# Altium project HotBox.PrjPcb
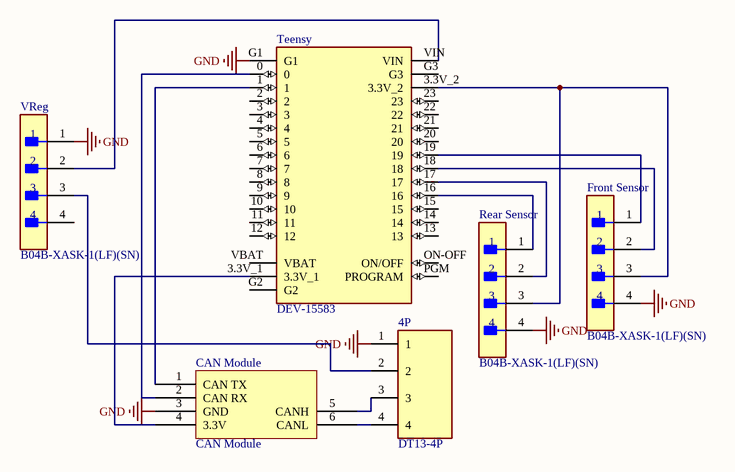
[diagram p0: HotBox.SchDoc]
1 sheet, 6 parts. Net scope: global (net labels, ports and power ports of the same name join across sheets).
Board file: Hotbox.PcbDoc

## Sheet HotBox.SchDoc
size A2; SheetNumber: 1; SheetTotal: 1

### Parts
4P  DT13-4P  [TE_DT13-4P]
CAN_Module  CAN Module  [CAN Module-Footprint-1]
Front_Sensor  B04B-XASK-1(LF)(SN)  [FP-B04B-XASK-1_LF_SN-MFG]
Rear_Sensor  B04B-XASK-1(LF)(SN)  [FP-B04B-XASK-1_LF_SN-MFG]
Teensy  DEV-15583  [MODULE_DEV-15583]
VReg  B04B-XASK-1(LF)(SN)  [FP-B04B-XASK-1_LF_SN-MFG]

### Nets
GND: 4P.1 CAN_Module.3(GND) Front_Sensor.4 Rear_Sensor.4 Teensy.G1 VReg.1
Net4P_2: 4P.2 VReg.3
Net4P_3: 4P.3 CAN_Module.5(CANH)
Net4P_4: 4P.4 CAN_Module.6(CANL)
NetCAN_Module_1: CAN_Module.1(CAN_TX) Teensy.1
NetCAN_Module_2: CAN_Module.2(CAN_RX) Teensy.0
NetCAN_Module_4: CAN_Module.4(3.3V) Teensy.3.3V_1
NetFront_Sensor_1: Front_Sensor.1 Teensy.19
NetFront_Sensor_2: Front_Sensor.2 Teensy.18
NetFront_Sensor_3: Front_Sensor.3 Rear_Sensor.3 Teensy.3.3V_2
NetRear_Sensor_1: Rear_Sensor.1 Teensy.16
NetRear_Sensor_2: Rear_Sensor.2 Teensy.17
NetTeensy_VIN: Teensy.VIN VReg.2

Not connected (* = marked no-connect by the designer): Teensy 2 3 4 5 6 7 8 9 10 11 12 13 14 15 20 21 22 23 G2 G3 ON-OFF(ON/OFF) PGM(PROGRAM) VBAT; VReg 4

### Library data of the parts
4P = DT13-4P: DT13 Series, 4.44mm Pitch 4 Way 2 Row Right Angle PCB Header, Solder Termination; MF: TE Connectivity; SnapEDA_Link: https://www.snapeda.com/parts/DT13-4P/TE%20Connectivity%20Deutsch%20Connectors/view-part/2708791/?ref=snap; MP: DT13-4P; TE_purchase_URL: https://www.te.com/usa-en/product-DT13-4P.html?te_bu=Cor&te_type=disp&te_campaign=seda_glo_cor-seda-global-disp-prtnr-fy19-seda-model-bom-cta_sma-317_1&elqCampaignId=32493; Availability: Unavailable; Value: *; Price: None; Package: None
CAN_Module = CMP-00030-00003-1: CAN waveshare
Front_Sensor Rear_Sensor VReg = CMP-17439-000018-1: CONN HEADER VERT 4POS 2.5MM; Manufacturer: JST; Current Rating: 3A; Voltage Rating: 250V; Conn Orientation: Straight; Conn Gender: Male; Number Of Contacts: 4; ComponentLink2Description: Datasheet; Package: B04B-XASK-1(LF)(SN); Octopart: https://octopart.com/b04b-xask-1%28lf%29%28sn%29-jst-3990149; Pitch: 2.5mm; Device Class L1: Connectors; RoHS: TRUE; Device Class L3: unset; Manufacturer Part Number: B04B-XASK-1(LF)(SN); Temperature Range High: +85°C; Height: 8.8mm; Lead Free: Yes; Category: Conn; Temperature: -25°C to +85°C; Digikey Description: CONN HEADER VERT 4POS 2.5MM; Temperature Range Low: -25°C; ComponentLink2URL: http://www.jst-mfg.com/product/pdf/eng/eXA1.pdf; Contact Material: Tin,Copper; Device Class L2: Headers and Wire Housings; Automotive: No; Number Of Rows: 1
Teensy = DEV-15583: RT1062 Teensy 4.0 i.MX ARMÂ® CortexÂ®-M7 MPU Embedded Evaluation Board; MF: SparkFun Electronics; Value: *; Package: None; Digi-Key_Part_Number: 1568-DEV-15583-ND; Digi-Key_Purchase_URL: https://www.digikey.com/product-detail/en/sparkfun-electronics/DEV-15583/1568-DEV-15583-ND/10384551?utm_source=snapeda&utm_medium=aggregator&utm_campaign=symbol; MP: DEV-15583; SnapEDA_Link: https://www.snapeda.com/parts/DEV-15583/SparkFun%20Electronics/view-part/4001229/?ref=snap